# Altium schematic sheet PassStat.SchDoc
size A2; SheetNumber: 1; SheetTotal: 1
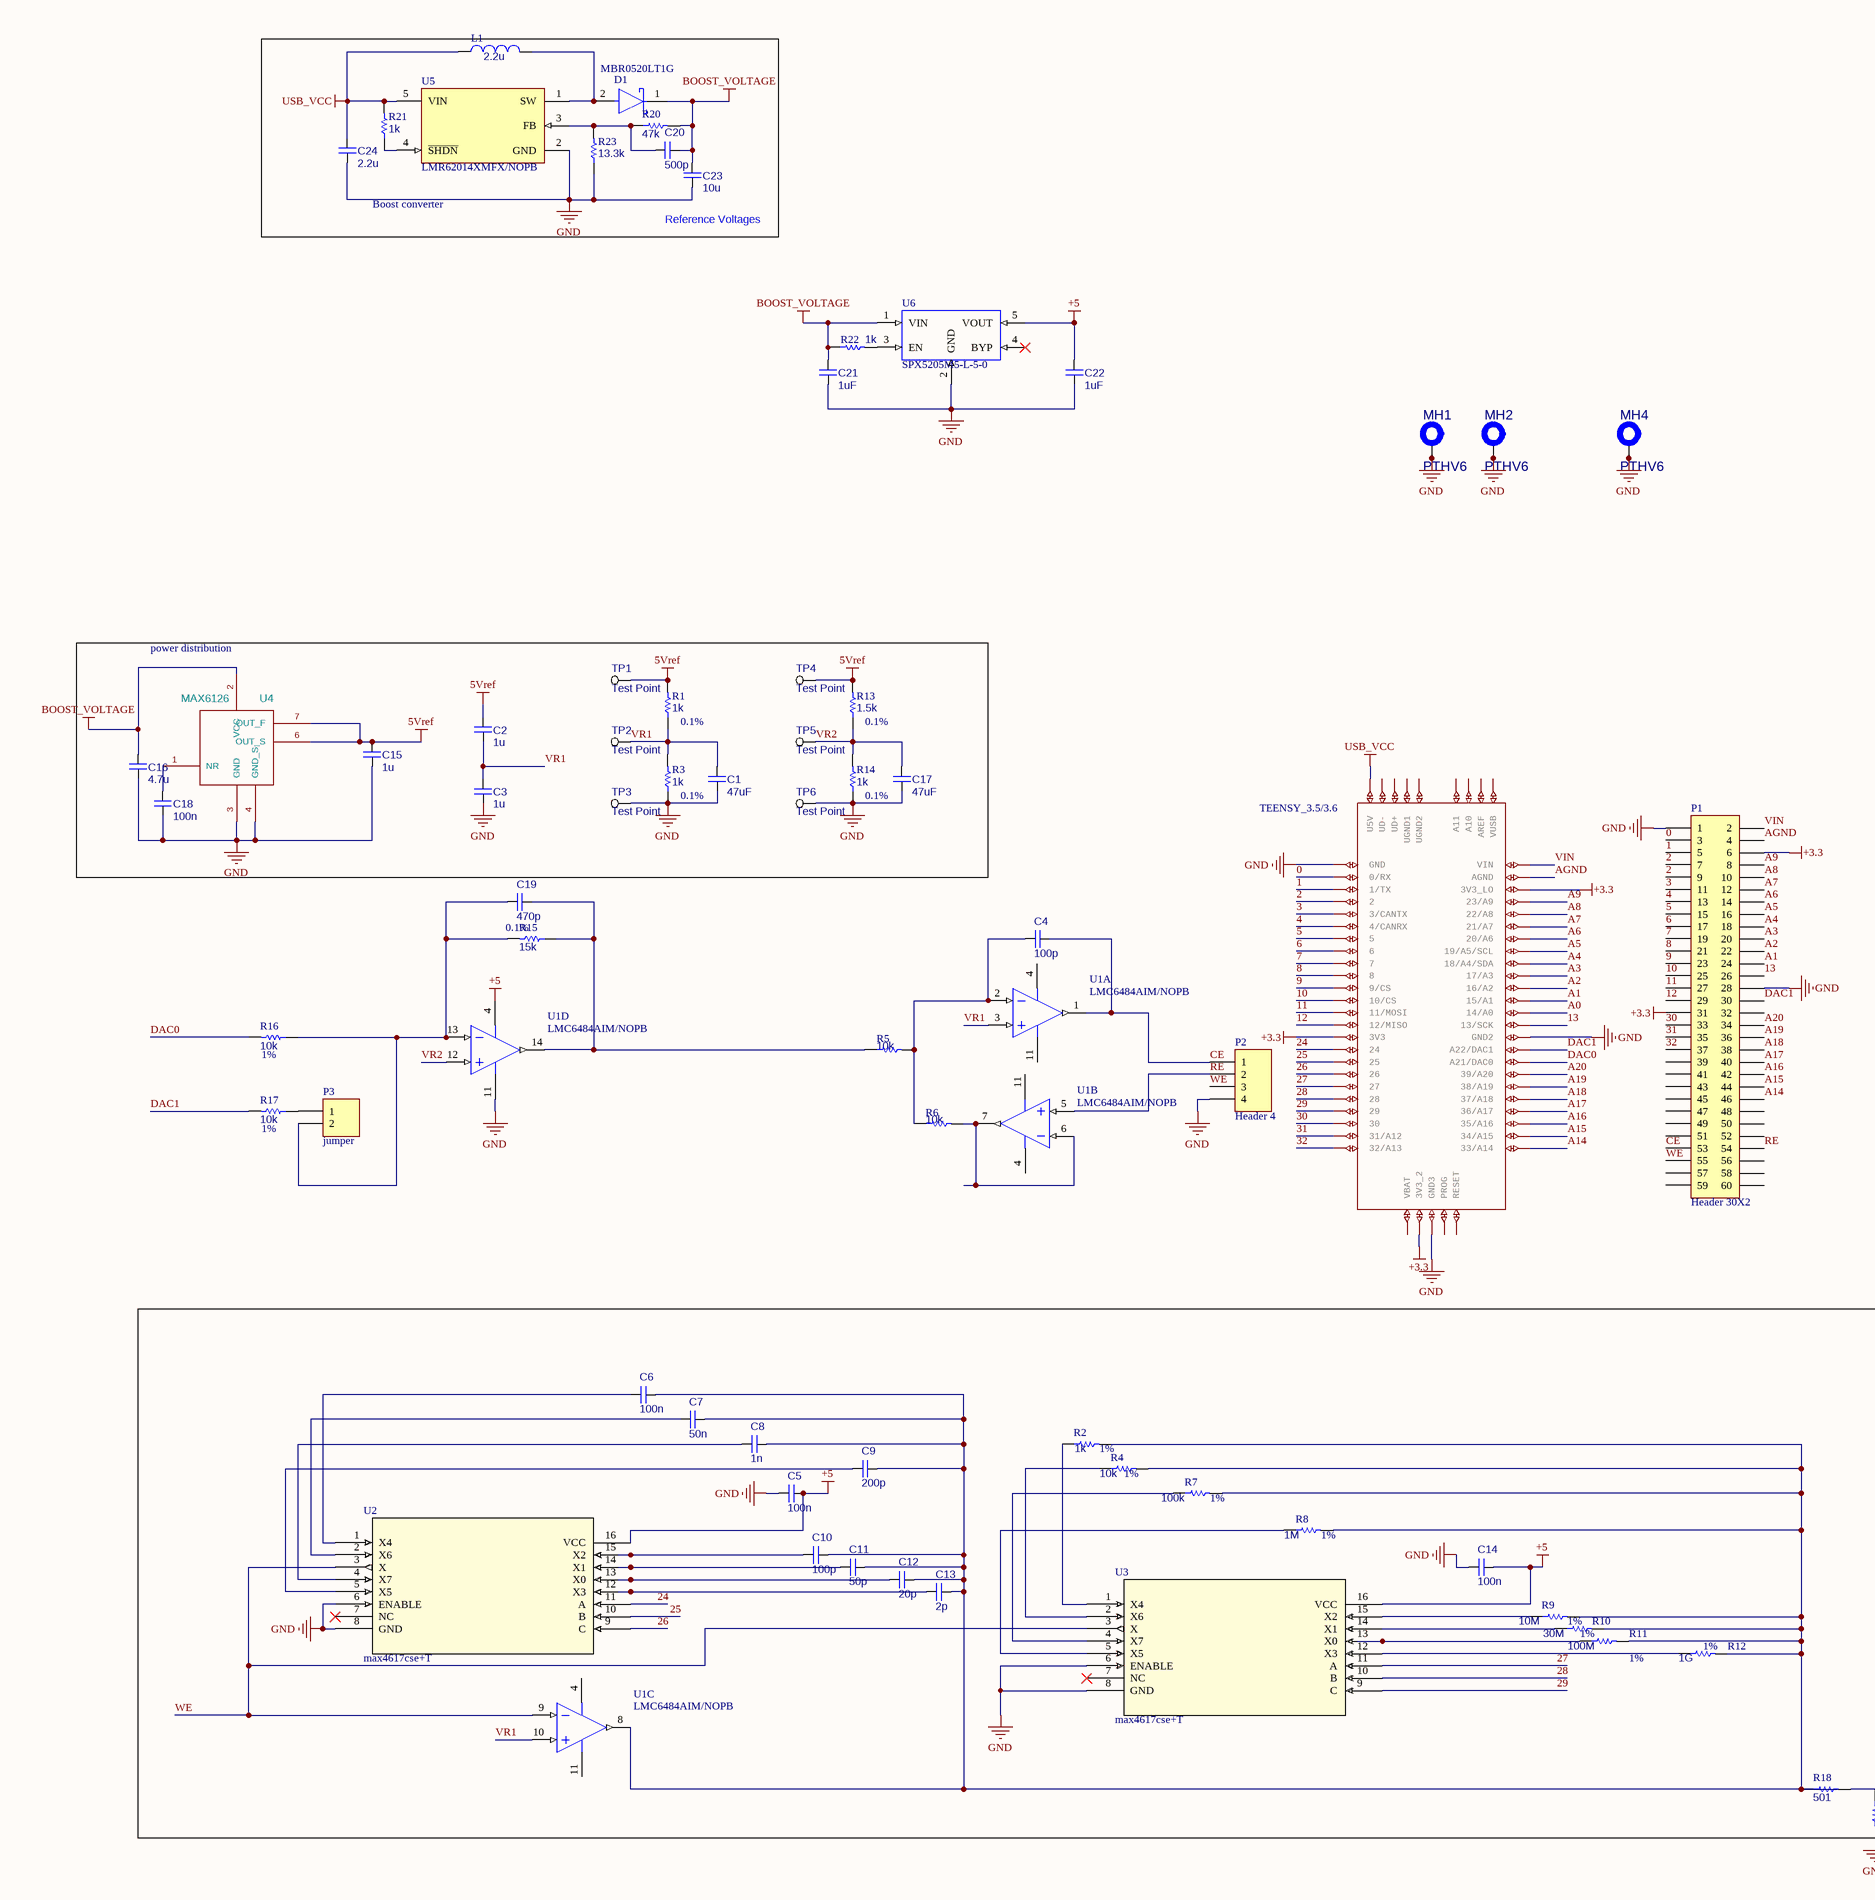
[diagram p0: PassStat.SchDoc, left]
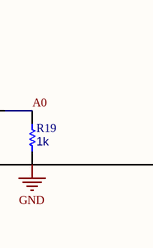
[diagram p1: PassStat.SchDoc, right]

## Parts
C1  value 47uF  [C0805A]  (hidden comment: Capacitor)
C2  value 1u  [C0805A]  (hidden comment: Capacitor)
C3  value 1u  [C0805A]  (hidden comment: Capacitor)
C4  value 100p  [C0805A]  (hidden comment: Capacitor)
C5  value 100n  [C0805A]  (hidden comment: Capacitor)
C6  value 100n  [C0805A]  (hidden comment: Capacitor)
C7  value 50n  [C0805A]  (hidden comment: Capacitor)
C8  value 1n  [C0805A]  (hidden comment: Capacitor)
C9  value 200p  [C0805A]  (hidden comment: Capacitor)
C10  value 100p  [C0805A]  (hidden comment: Capacitor)
C11  value 50p  [C0805A]  (hidden comment: Capacitor)
C12  value 20p  [C0805A]  (hidden comment: Capacitor)
C13  value 2p  [C0805A]  (hidden comment: Capacitor)
C14  value 100n  [C0805A]  (hidden comment: Capacitor)
C15  value 1u  [C0805A]  (hidden comment: Capacitor)
C16  value 4.7u  [C0805A]  (hidden comment: Capacitor)
C17  value 47uF  [C0805A]  (hidden comment: Capacitor)
C18  value 100n  [C0805A]  (hidden comment: Capacitor)
C19  value 470p  [C0805A]  (hidden comment: Capacitor)
C20  value 500p  [C0805A]  (hidden comment: Capacitor)
C21  value 1uF  [C0603A]  (hidden comment: Capacitor)
C22  value 1uF  [C0603A]  (hidden comment: Capacitor)
C23  value 10u  [C0805A]  (hidden comment: Capacitor)
C24  value 2.2u  [C0805A]  (hidden comment: Capacitor)
D1  MBR0520LT1G  [FP-425-04-IPC_C]
L1  value 2.2u  [L0805A]  (hidden comment: 2.2uH)
MCU  TEENSY_3.5/3.6  [TEENSY_3.5/3.6]
MH1  PTHV6  [PTHV6 4-40 Tight]  (net tie, no BOM)
MH2  PTHV6  [PTHV6 4-40 Tight]  (net tie, no BOM)
MH4  PTHV6  [PTHV6 4-40 Tight]  (net tie, no BOM)
P1  Header 30X2  [HDR2X30]
P2  Header 4  [HDR1X4]
P3  jumper  [HDR1X2]
R1  value 1k  Tolerance: 0.1%  [R0805A]  (hidden comment: Resistor)
R2  value 1k  Tolerance: 1%  [R0805A]  (hidden comment: Resistor)
R3  value 1k  Tolerance: 0.1%  [R0805A]  (hidden comment: Resistor)
R4  value 10k  Tolerance: 1%  [R0805A]  (hidden comment: Resistor)
R5  value 10k  [R0805A]  (hidden comment: Resistor)
R6  value 10k  [R0805A]  (hidden comment: Resistor)
R7  value 100k  Tolerance: 1%  [R0805A]  (hidden comment: Resistor)
R8  value 1M  Tolerance: 1%  [R0805A]  (hidden comment: Resistor)
R9  value 10M  Tolerance: 1%  [R0805A]  (hidden comment: Resistor)
R10  value 30M  Tolerance: 1%  [R0805A]  (hidden comment: Resistor)
R11  value 100M  Tolerance: 1%  [R0805A]  (hidden comment: Resistor)
R12  value 1G  Tolerance: 1%  [R1206A]  (hidden comment: Resistor)
R13  value 1.5k  Tolerance: 0.1%  [R0805A]  (hidden comment: Resistor)
R14  value 1k  Tolerance: 0.1%  [R0805A]  (hidden comment: Resistor)
R15  value 15k  Tolerance: 0.1%  [R0805A]  (hidden comment: Resistor)
R16  value 10k  Tolerance: 1%  [R0805A]  (hidden comment: Resistor)
R17  value 10k  Tolerance: 1%  [R0805A]  (hidden comment: Resistor)
R18  value 501  [R0805A]  (hidden comment: Resistor)
R19  value 1k  [R0805A]  (hidden comment: Resistor)
R20  value 47k  [R0603A]  (hidden comment: Resistor)
R21  value 1k  [R0603A]  (hidden comment: Resistor)
R22  value 1k  [R0603A]  (hidden comment: Resistor)
R23  value 13.3k  [R0603A]  (hidden comment: Resistor)
TP1  Test Point  [TP-SMT-1mm]  (no BOM)
TP2  Test Point  [TP-SMT-1mm]  (no BOM)
TP3  Test Point  [TP-SMT-1mm]  (no BOM)
TP4  Test Point  [TP-SMT-1mm]  (no BOM)
TP5  Test Point  [TP-SMT-1mm]  (no BOM)
TP6  Test Point  [TP-SMT-1mm]  (no BOM)
U1  LMC6484AIM/NOPB  [D0014A_L]  (parts A,B,C,D of 4)
U2  max4617cse+T  [21-0041_S16+1_MXM]
U3  max4617cse+T  [21-0041_S16+1_MXM]
U4  value MAX6126  [SOIC-8_3.9x4.9mm_Pitch1.27mm]  (hidden comment: MAX6126AASA50+)
U5  LMR62014XMFX/NOPB  [FP-DBV0005A-MFG]
U6  SPX5205M5-L-5-0  [SOT95P280X145-5N]

## Blocks framed on the sheet
power distribution: C1-C3 C15-C18 R1 R3 R13 R14 TP1-TP6 U4

## Nets
5Vref: C2.2 C15.2 R1.2 R13.2 TP1.1(Pad) TP4.1(Pad) U4.6(OUT_S) U4.7(OUT_F)
+3.3: MCU.3V3 MCU.3V3_2 MCU.3V3_LO P1.6 P1.31
+5: C5.2 C14.2 C22.2 U1.4(V+) U2.16(VCC) U3.16(VCC) U6.5(VOUT)
BOOST_VOLTAGE: C16.2 C20.1 C21.2 C23.2 D1.1(C) R20.2 R22.1 U4.2(VCC) U6.1(VIN)
GND: C1.1 C3.1 C5.1 C14.1 C15.1 C16.1 C17.1 C18.1 C21.1 C22.1 C23.1 C24.1 MCU.GND MCU.GND2 MCU.GND3 MH1.1(MH) MH1.2(V1) MH1.3(V2) MH1.4(V3) MH1.5(V4) MH1.6(V5) MH1.7(V6) MH2.1(MH) MH2.2(V1) MH2.3(V2) MH2.4(V3) MH2.5(V4) MH2.6(V5) MH2.7(V6) MH4.1(MH) MH4.2(V1) MH4.3(V2) MH4.4(V3) MH4.5(V4) MH4.6(V5) MH4.7(V6) P1.1 P1.28 P2.4 R3.1 R14.1 R19.2 R23.1 TP3.1(Pad) TP6.1(Pad) U1.11(V-) U2.6(ENABLE) U2.8(GND) U3.6(ENABLE) U3.8(GND) U4.3(GND) U4.4(GND_S) U5.2(GND) U6.2(GND)
USB_VCC: C24.2 L1.1 MCU.U5V R21.2 U5.5(VIN)
0: MCU.0/RX P1.3
1: MCU.1/TX P1.5
2: MCU.2 P1.7 P1.9
3: MCU.3/CANTX P1.11
4: MCU.4/CANRX P1.13
5: MCU.5 P1.15
6: MCU.6 P1.17
7: MCU.7 P1.19
8: MCU.8 P1.21
9: MCU.9/CS P1.23
10: MCU.10/CS P1.25
11: MCU.11/MOSI P1.27
12: MCU.12/MISO P1.29
13: MCU.13/SCK P1.26
24: MCU.24 U2.11(A)
25: MCU.25 U2.10(B)
26: MCU.26 U2.9(C)
27: MCU.27 U3.11(A)
28: MCU.28 U3.10(B)
29: MCU.29 U3.9(C)
30: MCU.30 P1.33
31: MCU.31/A12 P1.35
32: MCU.32/A13 P1.37
A0: MCU.14/A0 R18.2 R19.1
A1: MCU.15/A1 P1.24
A2: MCU.16/A2 P1.22
A3: MCU.17/A3 P1.20
A4: MCU.18/A4/SDA P1.18
A5: MCU.19/A5/SCL P1.16
A6: MCU.20/A6 P1.14
A7: MCU.21/A7 P1.12
A8: MCU.22/A8 P1.10
A9: MCU.23/A9 P1.8
A14: MCU.33/A14 P1.46
A15: MCU.34/A15 P1.44
A16: MCU.35/A16 P1.42
A17: MCU.36/A17 P1.40
A18: MCU.37/A18 P1.38
A19: MCU.38/A19 P1.36
A20: MCU.39/A20 P1.34
AGND: MCU.AGND P1.4
CE: C4.2 P1.53 P2.1 U1.1(OUT1)
DAC0: MCU.21/DAC0(A21/DAC0) R16.2
DAC1: MCU.A22/DAC1 P1.30 R17.2
RE: P1.54 P2.2 U1.5(IN2+)
VIN: MCU.VIN P1.2
VR1: C1.2 C2.1 C3.2 R1.1 R3.2 TP2.1(Pad) U1.3(IN1+) U1.10(IN3+)
VR2: C17.2 R13.1 R14.2 TP5.1(Pad) U1.12(IN4+)
WE: P1.55 P2.3 U1.9(IN3-) U2.3(X) U3.3(X)
NetC4_1: C4.1 R5.2 R6.1 U1.2(IN1-)
NetC6_1: C6.1 U2.1(X4)
NetC6_2: C6.2 C7.2 C8.2 C9.2 C10.2 C11.2 C12.2 C13.2 R2.2 R4.2 R7.2 R8.2 R9.2 R10.2 R11.2 R12.2 R18.1 U1.8(OUT3)
NetC7_1: C7.1 U2.2(X6)
NetC8_1: C8.1 U2.4(X7)
NetC9_1: C9.1 U2.5(X5)
NetC10_1: C10.1 U2.15(X2)
NetC11_1: C11.1 U2.14(X1)
NetC12_1: C12.1 U2.13(X0)
NetC13_1: C13.1 U2.12(X3)
NetC18_2: C18.2 U4.1(NR)
NetC19_1: C19.1 R5.1 R15.1 U1.14(OUT4)
NetC19_2: C19.2 P3.2 R15.2 R16.1 U1.13(IN4-)
NetC20_2: C20.2 R20.1 R23.2 U5.3(FB)
NetD1_2: D1.2(A) L1.2 U5.1(SW)
NetP3_1: P3.1 R17.1
NetR2_1: R2.1 U3.1(X4)
NetR4_1: R4.1 U3.2(X6)
NetR6_2: R6.2 U1.6(IN2-) U1.7(OUT2)
NetR7_1: R7.1 U3.4(X7)
NetR8_1: R8.1 U3.5(X5)
NetR9_1: R9.1 U3.15(X2)
NetR10_1: R10.1 U3.14(X1)
NetR11_1: R11.1 U3.13(X0)
NetR12_1: R12.1 U3.12(X3)
NetR21_1: R21.1 U5.4(~{SHDN})
NetR22_2: R22.2 U6.3(EN)

Not connected (* = marked no-connect by the designer): MCU A10 A11 AREF PROG RESET UD+ UD- UGND1 UGND2 VBAT VUSB; P1 32 39 41 43 45 47 48 49 50 51 52 56 57 58 59 60; U2 7(NC)*; U3 7(NC)*; U6 4(BYP)*

## Notes on the sheet
- Boost converter
- (near C23) Reference Voltages

## Library data of the parts
C1-C24 = CMP-001-00000-10: Non-polarized capacitor
D1 = CMP-1055-00425-2: DIODE SCHOTTKY 20V 500MA SOD123; Polarity: Standard; Peak Non-Repetitive Surge Current: 5.5A; Forward Voltage: 385mV; Element Configuration: Single; Peak Reverse Current: 250uA; Max Repetitive Reverse Voltage (Vrrm): 20V; Voltage Rating (DC): 20V; Case/Package: SOD-123-2; Number of Pins: 2; Output Current: 500mA; Min Operating Temperature: -65°C; Lead Free: Lead Free; REACH SVHC: No SVHC; Max Reverse Voltage (DC): 20V; Termination: SMD/SMT; Average Rectified Current: 500mA; Max Surge Current: 5.5A; Package Quantity: 3000; Height: 1.12mm; Current Rating: 500mA; Forward Current: 500mA; Max Forward Surge Current (Ifsm): 5.5A; Packaging: Tape and Reel; Length: 2.69mm; Radiation Hardening: No; Max Reverse Leakage Current: 250uA; Width: 1.6mm; Contact Plating: Tin; Max Operating Temperature: 125°C
L1 = CMP-006-00000-4: Inductor, air coil
MCU = CMP-002-0004-1: GateName_1: G$1; Source: Teensy356.SCHLIB; Package: TEENSY_3.5/3.6; LibraryName: Teensy356; DeviceSetName: TEENSY_3.5/3.6; Design Item ID: TEENSY_3.5/3.6; SymbolName_1: TEENSY_3.5/3.6
MH1 MH2 MH4 = CMP-00028-00001-9: Plated mounting hole with 6 peripheral vias. This is a generic symbol that groups all relevant footprints.
P1 = CMP-005-000092-1: Header, 30-Pin, Dual row; Signal Integrity: Connector; LatestRevisionDate: 17-Jul-2002; Source: Miscellaneous Connectors.SchLib; Component Type: Standard; Design Item ID: Header 30X2; Publisher: Altium Limited; Pin Count: 60; LatestRevisionNote: Re-released for DXP Platform.
P2 = CMP-005-000097-2: Header, 4-Pin; Signal Integrity: Connector; LatestRevisionNote: Re-released for DXP Platform.; Pin Count: 4; Component Type: Standard; Publisher: Altium Limited; Source: Miscellaneous Connectors.SchLib; LatestRevisionDate: 17-Jul-2002; Design Item ID: Header 4
P3 = CMP-005-000070-1: Header, 2-Pin; Signal Integrity: Connector; Design Item ID: Header 2; Pin Count: 2; LatestRevisionNote: Re-released for DXP Platform.; Publisher: Altium Limited; Source: Miscellaneous Connectors.SchLib; Component Type: Standard; LatestRevisionDate: 17-Jul-2002
R1-R23 = CMP-009-00002-14
TP1-TP6 = CMP-002-00006-5: In circuit test point for a net
U1 = CMP-0055-00819-3: CMOS Quad Rail to Rail Input and Output Operational Amplifier, 14-pin Narrow SOIC, Pb-Free; Manufacturer: Texas Instruments; PackageTopMarking: NSUZXYTTE#*LMC6484*AIM; CompType: Amplifiers; PowerWise: N; Package Reference: D0014A; ComponentLink1URL: http://www.ti.com/general/docs/lit/getliterature.tsp?genericPartNumber=LMC6484&fileType=pdf; Code_JEDEC: MS-012AB; RoHS: Y; ComponentLink1Description: Datasheet URL; PinCount: 14; Code_IPC: SOIC127P600-14; PackageDescription: Molded Package S.O., .150in Wide, 14 Lead
U2 U3 = CMP-002-000033-1: No Description Available; Mfr_Name: Analog Devices Inc; Design Item ID: max4617cse+T; Type: Type; RefDes: RefDes; Source: max4617cse&plus_T.SchLib
U4 = MAX6126: Three Terminal Voltage Reference, 1 Output, 5V, BICMOS, PDSO8; Manufacturer: Maxim; MFN: Maxim Integrated; MFP: MAX6126AASA30+; Package Body Material: Plastic; Channels: 1; Max Output Voltage: 5.001V; Min Output Voltage: 4.999V; Package Equivalence Code: SOP8,.25; Max Supply Voltage: 12.6V; Min Supply Voltage: 5.2V; Nominal Supply Voltage: 5.5V; Temp Coef of Voltage-Max: 5ppm/°C; Trim/Adjustable Output: No; Qualification Status: Not Qualified; Supplier: Mouser; Footprint: Housings_SOIC:SOIC-8_3.9x4.9mm_Pitch1.27mm; Supplier Part Number: MAX6126AASA50+-ND; Manufacturer Part Number: MAX6126AASA50+; RoHS: Yes; Category: Voltage References; Stock: 569; Pricing: 1=11.35, 10=10.256, 25=9.7784, 100=8.4906, 250=8.109, 500=7.3935, 1000=7.155 (USD); Case/Package: SOP; Pins: 8; Package Shape: Rectangular; Terminal Finish: Tin; Min Operating Temperature: -40°C; Max Operating Temperature: 125°C; JESD-609 Code: e3; Throw Configuration: THREE TERMINAL VOLTAGE REFERENCE; JESD-30 Code: R-PDSO-G8; Moisture Sensitivity Level: 1; Number of Outputs: 1; Nominal Output Voltage: 5V; Package Style: SMALL OUTLINEMeter; Peak Reflow Temperature (Cel): 260°C; Surface Mount: Yes; Technology: BICMOS; Terminal Form: Gull Wing; Terminal Position: DUAL; Length: 4.9mm; Width: 3.9mm; Height - Seated (Max): 1.75mm; Terminal Pitch: 1.27mm; Temperature Grade: AUTOMOTIVE; Reach SVHC Compliant: Yes; RoHS Compliant: Yes; ComponentLink1URL: https://datasheet.ciiva.com:443/pdfs/VipMasterIC/IC/MAXM/MAXM-S-A0002891914/MAXM-S-A0002891914-1.pdf?src-supplier=IHS+Markit; ComponentLink1Description: https://datasheet.ciiva.com:443/pdfs/VipMasterIC/IC/MAXM/MAXM-S-A0002891914/MAXM-S-A0002891914-1.pdf?src-supplier=IHS+Markit; ComponentLink2URL: https://datasheet.ciiva.com/22828/0900766b810958c3-22828415.pdf?src-supplier=Rs; ComponentLink2Description: https://datasheet.ciiva.com/22828/0900766b810958c3-22828415.pdf?src-supplier=Rs; ComponentLink3URL: https://datasheet.ciiva.com/2008/max6126-2008873.pdf?src-supplier=Digi-Key; ComponentLink3Description: https://datasheet.ciiva.com/2008/max6126-2008873.pdf?src-supplier=Digi-Key; ComponentLink4URL: https://datasheet.ciiva.com/3236/max6126-3236171.pdf?src-supplier=Avnet; ComponentLink4Description: https://datasheet.ciiva.com/3236/max6126-3236171.pdf?src-supplier=Avnet; ComponentLink5URL: https://datasheet.ciiva.com/14198/max6126-14198970.pdf?src-supplier=Avnet; ComponentLink5Description: https://datasheet.ciiva.com/14198/max6126-14198970.pdf?src-supplier=Avnet
U5 = CMP-04918-000185-1: IC REG BOOST ADJ 2A SOT23-5; Min Output Voltage: 3V; Switching Frequency: 1.6MHz; Max Output Current: 1.4A; Max Input Voltage: 14V; Quiescent Current: 2mA; Number of Outputs: 1; Synchronous Rectifier: No; Min Input Voltage: 2.7V; Max Output Voltage: 20V; Output Current: 1.8A; Output Type: Adjustable; Output Configuration: Positive; Series: SIMPLE SWITCHER®; Packaging: Tape and Reel; Case/Package: SOT-23-5; Contact Plating: Tin; Max Operating Temperature: 125°C; Lead Free: Lead Free; Package Quantity: 3000; Min Operating Temperature: -40°C; Number of Pins: 5; Output Voltage: 20V; Mount: Surface Mount; Topology: Boost; Radiation Hardening: No
U6 = CMP-019-00031-2: Fixed Positive LDO Regulator, 5V, 0.35V Dropout, BIPolar, PDSO5; Max Supply Voltage: 16V; RoHS Compliant: Yes; Pins: 5; Case/Package: LSSOP